# Altium schematic sheet 0194_GPP_MUX_B.SchDoc
size A3
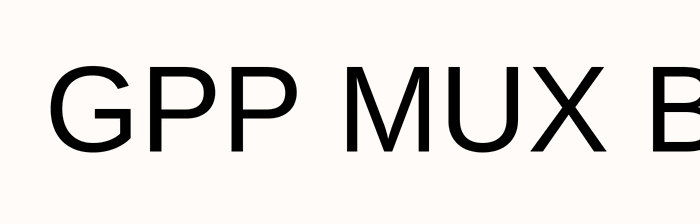
[diagram p0: 0194_GPP_MUX_B.SchDoc]

## Notes on the sheet
- GPP MUX B